# EasyEDA schematic 立创eda.json
TITLE: 基于ESP8266的带开关的开发板; REV: 1.0; Date: 2020-06-22; Sheet: 1/1; Drawn By: Ghost_axe
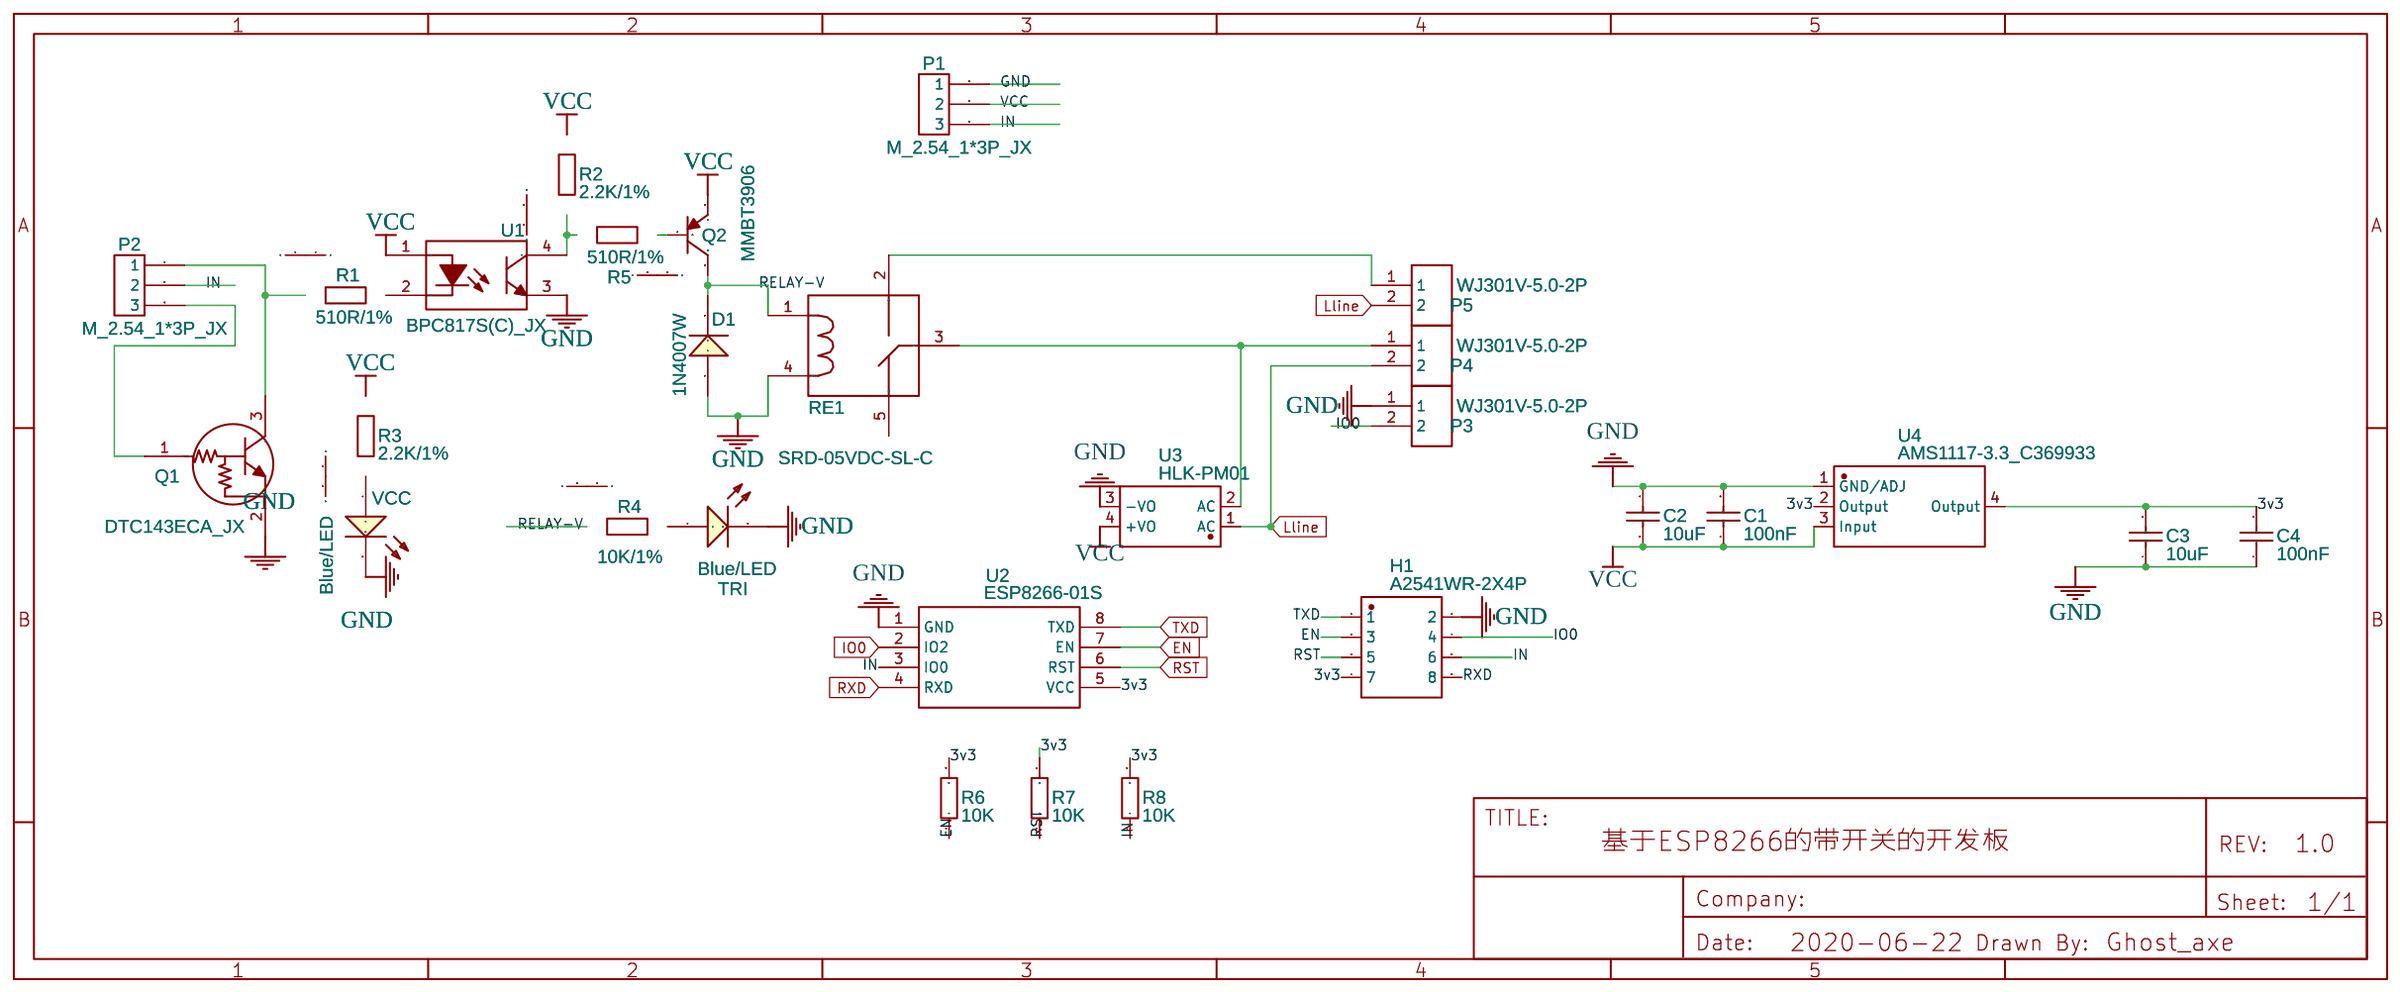
[diagram p0: schematic sheet]

## Parts
C1  100nF  [C0603]
C2  10uF  [C0805]
C3  10uF  [C0805]
C4  100nF  [C0603]
D1  1N4007W  [SOD-123_JX]
H1  A2541WR-2X4P  [HDR-TH_8P-P2.54-H-R2-C4-S2.54-W10.0_A2541WR]
P1  M_2.54_1*3P_JX  [M_2.54_1*3P_JX]
P2  M_2.54_1*3P_JX  [M_2.54_1*3P_JX]
P3  WJ301V-5.0-2P  [CONN-TH_2P-P5.00_WJ301V-5.00-2P]
P4  WJ301V-5.0-2P  [CONN-TH_2P-P5.00_WJ301V-5.00-2P]
P5  WJ301V-5.0-2P  [CONN-TH_2P-P5.00_WJ301V-5.00-2P]
Q1  DTC143ECA_JX  [SOT23_JX]
Q2  MMBT3906  [SOT23_JX]
R1  510R/1%  [0603_R_JX]
R2  2.2K/1%  [0603_R_JX]
R3  2.2K/1%  [0603_R_JX]
R4  10K/1%  [0603_R_JX]
R5  510R/1%  [0603_R_JX]
R6  10K  [R0603]
R7  10K  [R0603]
R8  10K  [R0603]
RE1  SRD-05VDC-SL-C  [RELAY_JX]
TRI  Blue/LED  [0603_D_JX]
U1  BPC817S(C)_JX  [SMD-4_JX]
U2  ESP8266-01S  [ESP8266-01]
U3  HLK-PM01  [PWRM-TH_HLK-PM01]
U4  AMS1117-3.3_C369933  [SOT-223-4_L6.5-W3.5-P2.30-LS7.0-BR]
VCC  Blue/LED  [0603_D_JX]

## Library data of the parts
C1 C4 = FN18X104K160PSG: Supplier: LCSC; Supplier Part: C235729; Manufacturer: Prosperity Dielectrics; Contributor: LCSC
C2 C3 = CL21A106KOCLRNC: Supplier: LCSC; Supplier Part: C318695; Manufacturer: Samsung Electro-Mechanics; Contributor: LCSC
D1 = -: Supplier: LCSC; Supplier Part: C108803; Package Display: No
H1 = A2541WR-2X4P: Supplier: LCSC; Supplier Part: C239335; Manufacturer: Changjiang Connectors; Manufacturer Part: A2541WR-2x4P; Contributor: LCSC; link: https://item.szlcsc.com/238439.html?ref=editor&logined=true
P1 P2 = -: Contributor: jixin002; Supplier: LCSC
P3-P5 = WJ301V-5.0-2P: Supplier: LCSC; Manufacturer: ReliaPro; image: //image.lceda.cn/szlcsc/C8475.jpg; Supplier Part: C8475
Q1 = -: Supplier: LCSC; Supplier Part: C13871; Package Display: No
Q2 U1 VCC = -: Supplier: LCSC
R1 = Resistor: Supplier: LCSC; Mounted: Yes
R2-R5 = Resistor: Supplier: LCSC
R6-R8 = RS-03K1002FT: Supplier: LCSC; Supplier Part: C115324; Manufacturer: Guangdong Fenghua Advanced Tech; Contributor: LCSC
RE1 = -: Manufacturer Part: 继电器; Supplier: LCSC; Contributor: jixin001; Supplier Part: C35449; Package Display: No
TRI = -: Supplier: LCSC; Supplier Part: C138541; Package Display: No
U2 = ESP8266-01S: Supplier: Aithinker; Contributor: zan_zzd
U3 = HLK-PM01: Supplier: LCSC; Supplier Part: C209903; Manufacturer: HI-LINK; Contributor: LCSC
U4 = AMS1117-3.3_C369933: Supplier: LCSC; Supplier Part: C369933; Manufacturer: KEXIN; Manufacturer Part: AMS1117-3.3; Contributor: LCSC; LCSC Assembly: Yes; SMT Type: Extend

## Nets
3v3: C3.2 C4.2 H1.7 R6.2 R7.2 R8.2 U2.5(VCC) U4.2(Output) U4.4(Output)
GND: C1.2 C2.2 C3.1 C4.1 D1.1(A) H1.2 P1.1 P3.1 Q1.2(E) RE1.4 TRI.2(C) U1.3 U2.1(GND) U3.3(-VO) U4.1(GND/ADJ) VCC.2(C)
VCC: C1.1 C2.1 P1.2 Q2.2(E) R2.2 R3.2 U1.1 U3.4(+VO) U4.3(Input)
EN: H1.3 R6.1 U2.7(EN)
IN: H1.6 P1.3 P2.2 R8.1 U2.3(IO0)
IO0: H1.4 P3.2 U2.2(IO2)
Lline: P4.2 P5.2 U3.1(AC)
RELAY-V: D1.2(K) Q2.3(C) R4.1 RE1.1
RST: H1.5 R7.1 U2.6(RST)
RXD: H1.8 U2.4(RXD)
TXD: H1.1 U2.8(TXD)
Net-(P2-1): P2.1 Q1.3(C) R1.1
Net-(P2-3): P2.3 Q1.1(B)
Net-(P4-1): P4.1 RE1.3 U3.2(AC)
Net-(P5-1): P5.1 RE1.2
Net-(Q2-1): Q2.1(B) R5.1
Net-(R1-2): R1.2 U1.2
Net-(R2-1): R2.1 R5.2 U1.4
Net-(R3-1): R3.1 VCC.1(A)
Net-(R4-2): R4.2 TRI.1(A)

Not connected (* = marked no-connect by the designer): RE1 5
